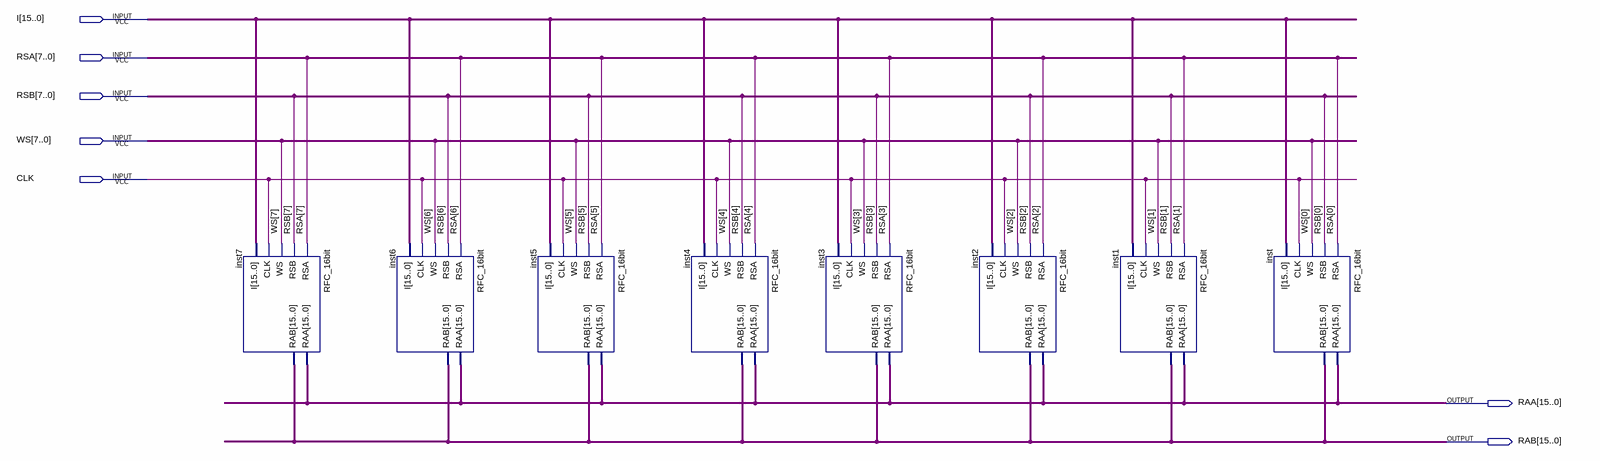
[diagram p0: schematic sheet]
// Quartus schematic RFC_8x16bit.bdf as structural Verilog: 8 symbols, 7 pins
module RFC_8x16bit (
  input  [15:0] I,
  input  [7:0] RSA,
  input  [7:0] RSB,
  input  [7:0] WS,
  input  CLK,
  output [15:0] RAA,
  output [15:0] RAB
);

  RFC_16bit inst7 (.RSA(RSA[7]), .RSB(RSB[7]), .WS(WS[7]), .CLK(CLK), .I(I), .RAA(RAA), .RAB(RAB));
  RFC_16bit inst6 (.RSA(RSA[6]), .RSB(RSB[6]), .WS(WS[6]), .CLK(CLK), .I(I), .RAA(RAA), .RAB(RAB));
  RFC_16bit inst5 (.RSA(RSA[5]), .RSB(RSB[5]), .WS(WS[5]), .CLK(CLK), .I(I), .RAA(RAA), .RAB(RAB));
  RFC_16bit inst4 (.RSA(RSA[4]), .RSB(RSB[4]), .WS(WS[4]), .CLK(CLK), .I(I), .RAA(RAA), .RAB(RAB));
  RFC_16bit inst3 (.RSA(RSA[3]), .RSB(RSB[3]), .WS(WS[3]), .CLK(CLK), .I(I), .RAA(RAA), .RAB(RAB));
  RFC_16bit inst2 (.RSA(RSA[2]), .RSB(RSB[2]), .WS(WS[2]), .CLK(CLK), .I(I), .RAA(RAA), .RAB(RAB));
  RFC_16bit inst1 (.RSA(RSA[1]), .RSB(RSB[1]), .WS(WS[1]), .CLK(CLK), .I(I), .RAA(RAA), .RAB(RAB));
  RFC_16bit inst (.RSA(RSA[0]), .RSB(RSB[0]), .WS(WS[0]), .CLK(CLK), .I(I), .RAA(RAA), .RAB(RAB));
endmodule
